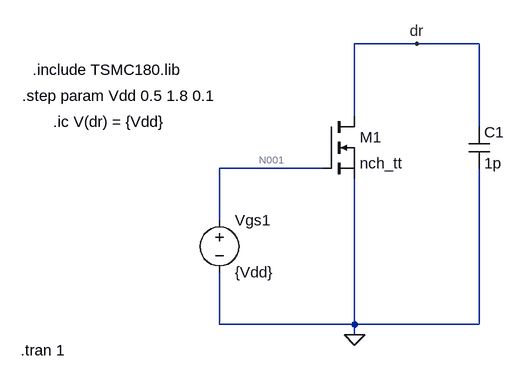
[diagram p0: schematic q1b.asc]
q1b.asc, the LTspice schematic file:
Version 4
SHEET 1 880 760
WIRE 320 272 224 272
WIRE 416 272 320 272
WIRE 224 384 224 272
WIRE 416 400 416 272
WIRE 176 464 16 464
WIRE 16 544 16 464
WIRE 16 704 16 624
WIRE 224 704 224 480
WIRE 224 704 16 704
WIRE 416 704 416 464
WIRE 416 704 224 704
WIRE 224 720 224 704
FLAG 224 720 0
FLAG 320 272 dr
SYMBOL nmos 176 384 R0
SYMATTR InstName M1
SYMATTR Value nch_tt
SYMATTR Value2 l=180n w=240n
SYMBOL voltage 16 528 R0
SYMATTR InstName Vgs1
SYMATTR Value {Vdd}
SYMBOL cap 400 400 R0
SYMATTR InstName C1
SYMATTR Value 1p
TEXT -272 312 Left 2 !.include TSMC180.lib
TEXT -288 352 Left 2 !.step param Vdd 0.5 1.8 0.1
TEXT -240 392 Left 2 !.ic V(dr) = {Vdd}
TEXT -290 744 Left 2 !.tran 1

The netlist it stands for:
* q1b.asc
M1 dr N001 0 0 nch_tt l=180n w=240n
Vgs1 N001 0 {Vdd}
C1 dr 0 1p
.model NMOS NMOS
.model PMOS PMOS
.lib standard.mos
.include TSMC180.lib
.step param Vdd 0.5 1.8 0.1
.ic V(dr) = {Vdd}
.tran 1
.backanno
.end

* Results of the author's LTspice run, read from the files saved beside the schematic
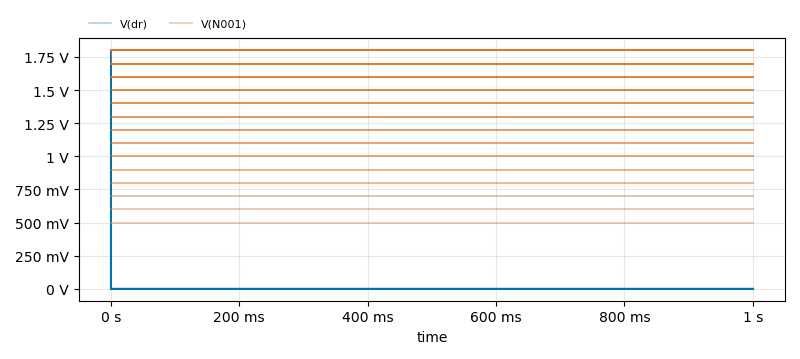
[diagram p1: Transient Analysis of q1b.asc, plotted from the saved traces]
* Transient Analysis, 14 runs:
*   V(dr) [vdd=0.5]: min 0 V, max 500 mV, average 4.294 µV, rms 207 µV, last 0 V
*   V(dr) [vdd=0.6]: min -102.5 nV, max 600 mV, average 0 V, rms 117.5 µV, last 0 V
*   V(dr) [vdd=0.7]: min 0 V, max 700 mV, average 0 V, rms 91.1 µV, last 0 V
*   V(dr) [vdd=0.8]: min 0 V, max 800 mV, average 1.429 µV, rms 82.3 µV, last 0 V
*   V(dr) [vdd=0.9]: min 0 V, max 900 mV, average 0 V, rms 80.4 µV, last 0 V
*   V(dr) [vdd=1]: min 0 V, max 1 V, average 743.2 nV, rms 80.09 µV, last 0 V
*   V(dr) [vdd=1.1]: min 0 V, max 1.1 V, average 146 nV, rms 81.29 µV, last 0 V
*   V(dr) [vdd=1.2]: min 0 V, max 1.2 V, average 0 V, rms 83.69 µV, last 0 V
*   V(N001) [vdd=0.5]: min 500 mV, max 500 mV, average 500 mV, rms 500 mV, last 500 mV
*   V(N001) [vdd=0.6]: min 600 mV, max 600 mV, average 600 mV, rms 600 mV, last 600 mV
*   V(N001) [vdd=0.7]: min 700 mV, max 700 mV, average 700 mV, rms 700 mV, last 700 mV
*   V(N001) [vdd=0.8]: min 800 mV, max 800 mV, average 800 mV, rms 800 mV, last 800 mV
*   V(N001) [vdd=0.9]: min 900 mV, max 900 mV, average 900 mV, rms 900 mV, last 900 mV
*   V(N001) [vdd=1]: min 1 V, max 1 V, average 1 V, rms 1 V, last 1 V
*   V(N001) [vdd=1.1]: min 1.1 V, max 1.1 V, average 1.1 V, rms 1.1 V, last 1.1 V
*   V(N001) [vdd=1.2]: min 1.2 V, max 1.2 V, average 1.2 V, rms 1.2 V, last 1.2 V